# Altium schematic sheet Sheet.SchDoc
size A; SheetNumber: 1; SheetTotal: 1
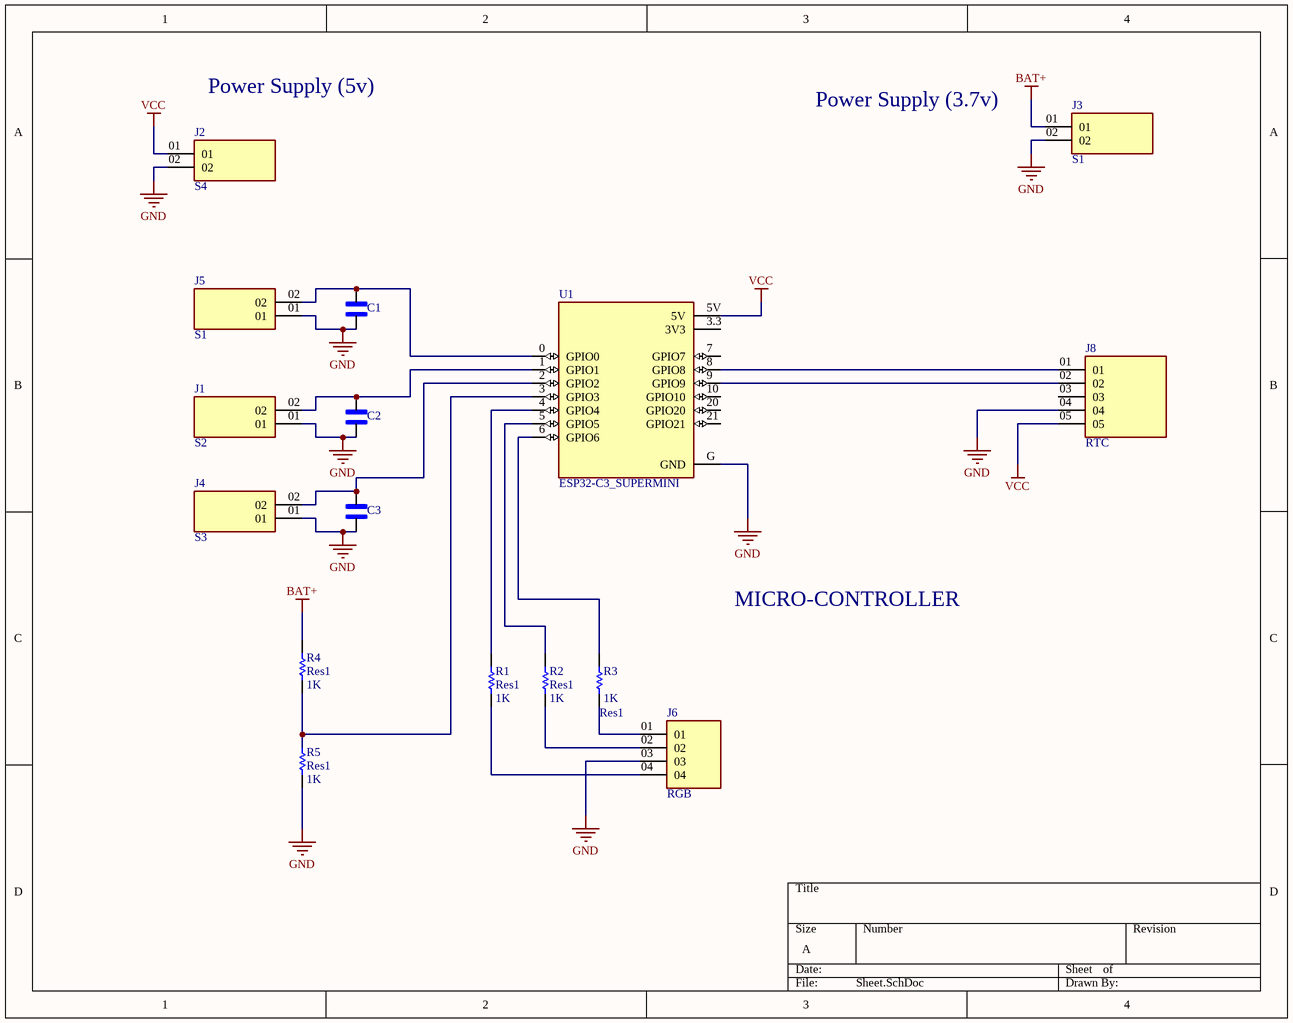
[diagram p0: Sheet.SchDoc]

## Parts
C1  C315C470J1G5TA  [CAPRR254W54L381T254H466]  (value not drawn)
C2  C315C470J1G5TA  [CAPRR254W54L381T254H466]  (value not drawn)
C3  C315C470J1G5TA  [CAPRR254W54L381T254H466]  (value not drawn)
J1  S2  [SAMTEC_TSW-202-07-T-S]
J2  S4  [SAMTEC_TSW-202-07-T-S]
J3  S1  [SAMTEC_TSW-202-07-T-S]
J4  S3  [SAMTEC_TSW-202-07-T-S]
J5  S1  [SAMTEC_TSW-202-07-T-S]
J6  RGB  [SAMTEC_MTLW-104-X-X-S-X]
J8  RTC  [SAMTEC_TSW-105-23-L-S]
R1  Res1  value 1K  [AXIAL-0.3]
R2  Res1  value 1K  [AXIAL-0.3]
R3  Res1  value 1K  [AXIAL-0.3]
R4  Res1  value 1K  [AXIAL-0.3]
R5  Res1  value 1K  [AXIAL-0.3]
U1  ESP32-C3_SUPERMINI  [MODULE_ESP32-C3_SUPERMINI]

## Nets
BAT+: J3.01 R4.1
GND: C1.1 C2.1 C3.1 J1.01 J2.02 J3.02 J4.01 J5.01 J6.03 J8.04 R5.2 U1.G(GND)
VCC: J2.01 J8.05 U1.5V
NetC1_2: C1.2 J5.02 U1.0(GPIO0)
NetC2_2: C2.2 J1.02 U1.1(GPIO1)
NetC3_2: C3.2 J4.02 U1.2(GPIO2)
NetJ6_01: J6.01 R3.2
NetJ6_02: J6.02 R2.2
NetJ6_04: J6.04 R1.2
NetJ8_01: J8.01 U1.8(GPIO8)
NetJ8_02: J8.02 U1.9(GPIO9)
NetR1_1: R1.1 U1.4(GPIO4)
NetR2_1: R2.1 U1.5(GPIO5)
NetR3_1: R3.1 U1.6(GPIO6)
NetR4_2: R4.2 R5.1 U1.3(GPIO3)

Not connected (* = marked no-connect by the designer): J8 03; U1 3.3(3V3) 7(GPIO7) 10(GPIO10) 20(GPIO20) 21(GPIO21)

## Notes on the sheet
- Power Supply (5v)
- (near J3) Power Supply (3.7v)
- MICRO-CONTROLLER

## Library data of the parts
C1-C3 = C315C470J1G5TA: Capacitor: ceramic; MLCC, monolithic; 47pF; 100V; C0G; Â±5%; THT; MF: KEMET; SnapEDA_Link: https://www.snapeda.com/parts/C315C470J1G5TA/KEMET/view-part/?ref=snap; Package: Radial Kemet; Value: *; MP: C315C470J1G5TA; Check_prices: https://www.snapeda.com/parts/C315C470J1G5TA/KEMET/view-part/?ref=eda
J1-J5 = TSW-202-07-T-S: Value: *; MP: TSW-202-07-T-S; Availability: Unavailable; Package: None; Price: None
J6 = MTLW-104-X-X-S-X: MF: {'manufacturer': u'Samtec Inc.'}; Package: None; Price: None; Value: *; MP: MTLW-104-X-X-S-X; Availability: Unavailable
J8 = TSW-105-23-L-S: Connector Header Through Hole 5 position 0.100 (2.54mm); MF: Samtec; Package: None; Value: *; SnapEDA_Link: https://www.snapeda.com/parts/TSW-105-23-L-S/Samtec/view-part/?ref=snap; Check_prices: https://www.snapeda.com/parts/TSW-105-23-L-S/Samtec/view-part/?ref=eda; Purchase-URL: https://pricing.snapeda.com/search/part/TSW-105-23-L-S/?ref=eda; MP: TSW-105-23-L-S; Digi-Key_Part_Number: SAM1071-05-ND
R1-R5 = Res1: Resistor; Published: 8-Jun-2000; LatestRevisionDate: 17-Jul-2002; LatestRevisionNote: Re-released for DXP Platform.; PackageReference: AXIAL-0.3; Publisher: Altium Limited; PackageDescription: Axial Device, Thru-Hole; 2 Leads; 0.3 in Pin Spacing
U1 = ESP32-C3_SUPERMINI: Super tiny ESP32-C3 board; MF: Espressif Systems; MP: ESP32-C3 SuperMini; SnapEDA_Link: https://www.snapeda.com/parts/ESP32-C3%20SuperMini/Espressif+Systems/view-part/?ref=snap; Package: Package; Value: *; Check_prices: https://www.snapeda.com/parts/ESP32-C3%20SuperMini/Espressif+Systems/view-part/?ref=eda